# EAGLE design mosfet board_v1 (EAGLE 7.7.0)
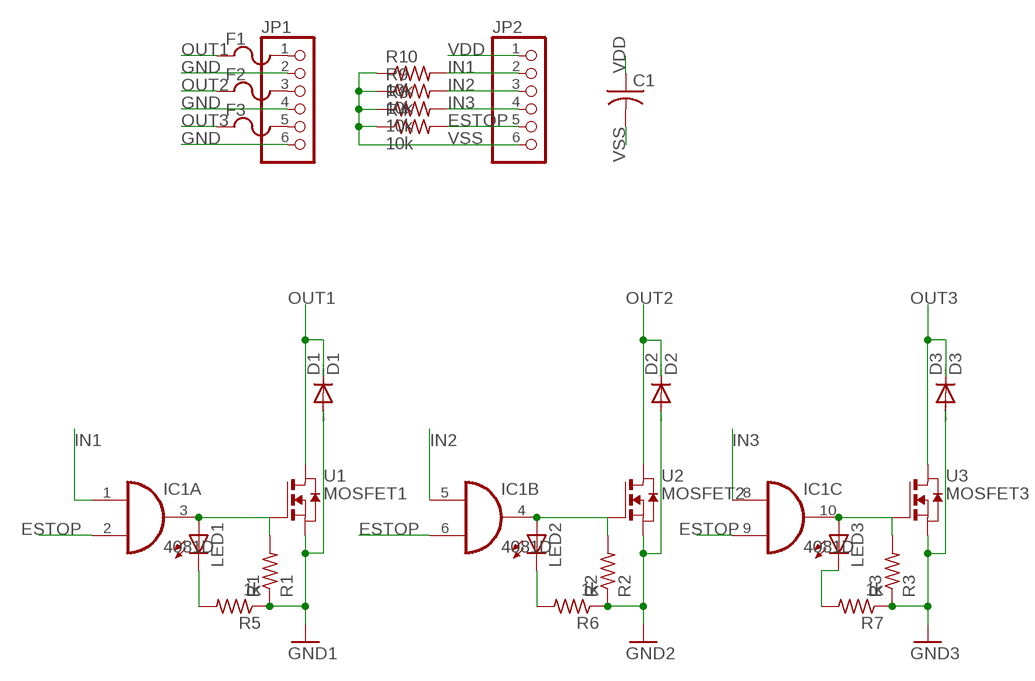
[diagram p0: schematic, sheet 1]

## Parts
C1  C-USC0603  [C0603]
D1  D1  1N4004  [DO41-10]
D2  D2  1N4004  [DO41-10]
D3  D3  1N4004  [DO41-10]
F1  POLYFUSE  [1206]
F2  POLYFUSE  [1206]
F3  POLYFUSE  [1206]
IC1  4081D  [SO14]
JP1  PINHD-1X6  [1X06]
JP2  PINHD-1X6  [1X06]
LED1  LEDCHIPLED_0603  [CHIPLED_0603]
LED2  LEDCHIPLED_0603  [CHIPLED_0603]
LED3  LEDCHIPLED_0603  [CHIPLED_0603]
R1  R1  R-US_R0603  [R0603]
R2  R2  R-US_R0603  [R0603]
R3  R3  R-US_R0603  [R0603]
R4  10k  R-US_R0603  [R0603]
R5  1k  R-US_R0603  [R0603]
R6  1k  R-US_R0603  [R0603]
R7  1k  R-US_R0603  [R0603]
R8  10k  R-US_R0603  [R0603]
R9  10k  R-US_R0603  [R0603]
R10  10k  R-US_R0603  [R0603]
U1  MOSFET1  MOSFET  [MOSFET]
U2  MOSFET2  MOSFET  [MOSFET]
U3  MOSFET3  MOSFET  [MOSFET]

## Nets
ESTOP: IC1.2(A:I1) IC1.6(B:I1) IC1.9(C:I1) JP2.5 R4.2
GND: D1.A D2.A D3.A JP1.2 JP1.4 JP1.6 R1.1 R2.1 R3.1 R5.1 R6.1 R7.1 U1.P$3(S) U2.P$3(S) U3.P$3(S) ; supply symbol labelled GND2, GND1, GND3
IN1: IC1.1(A:I0) JP2.2 R10.2
IN2: IC1.5(B:I0) JP2.3 R9.2
IN3: IC1.8(C:I0) JP2.4 R8.2
N$1: IC1.3(A:O) LED1.A R1.2 U1.P$1(G)
N$4: IC1.4(B:O) LED2.A R2.2 U2.P$1(G)
N$6: IC1.10(C:O) LED3.A R3.2 U3.P$1(G)
N$7: F1.2 JP1.1
N$8: F2.2 JP1.3
N$9: F3.2 JP1.5
N$10: LED1.C R5.2
N$11: LED2.C R6.2
N$12: LED3.C R7.2
OUT1: D1.C F1.1 U1.P$2(D)
OUT2: D2.C F2.1 U2.P$2(D)
OUT3: D3.C F3.1 U3.P$2(D)
VDD: C1.1 JP2.1
VSS: C1.2 JP2.6 R4.1 R8.1 R9.1 R10.1
Unconnected: IC1.11(D:O) IC1.12(D:I0) IC1.13(D:I1)

## Power pins joined to a net without a drawn wire
VDD: IC1.14(P:VDD)
VSS: IC1.7(P:VSS)

## Library data of the parts
C1 = E-P-008-R1.2:C-US: CAPACITOR, American symbol
D1-D3 = diode:1N4004: DIODE general purpose rectifier, 1 A
F1-F3 = polyfuse:POLYFUSE: Resistor Basic schematic elements and footprints for 0603, 1206, and PTH resistors.
IC1 = 40xx:4081: Quad 2-input AND
JP1 JP2 = adafruit:PINHD-1X6: PIN HEADER
LED1-LED3 = adafruit:LED: LED OSRAM: - CHIPLED LG R971, LG N971, LY N971, LG Q971, LY Q971, LO R971, LY R971 LH N974, LH R974 LS Q976, LO Q976, LY Q976 LO Q996 - Hyper CHIPLED LW Q18S LB Q993, LB Q99A, LB R99A - SideLED LS A670, LO A670, LY A670, LG A670, LP A670 LB A673, LV A673, LT A673, LW A673 LH A674 LY A675 LS A676, LA A676, LO A676, LY A676, LW A676 LS A679, LY A679, LG A679 - Hyper Micro SIDELED® LS Y876, LA Y876, LO Y876, LY Y876 LT Y87S - SmartLED LW L88C, LW L88S LB L89C, LB L89S, LG L890 LS L89K, LO L89K, LY L89K LS L896, LA L896, LO L896, LY L896 - TOPLED LS T670, LO T670, LY T670, LG T670, LP T670 LSG T670, LSP T670, LSY T670, LOP T670, LYG T670 LG T671, LOG T671, LSG T671 LB T673, LV T673, LT T673, LW T673 LH T674 LS T676, LA T676, LO T676, LY T676, LB T676, LH T676, LSB T676, LW T676 LB T67C, LV T67C, LT T67C, LS T67K, LO T67K, LY T67K, LW E67C LS E67B, LA E67B, LO E67B, LY E67B, LB E67C, LV E67C, LT E67C LW T67C LS T679, LY T679, LG T679 LS T770, LO T770, LY T770, LG T770, LP T770 LB T773, LV T773, LT T773, LW T773 LH T774 LS E675, LA E675, LY E675, LS T675 LS T776, LA T776, LO T776, LY T776, LB T776 LHGB T686 LT T68C, LB T68C - Hyper Mini TOPLED® LB M676 - Mini TOPLED Santana® LG M470 LS M47K, LO M47K, LY M47K Source: http://www.osram.convergy.de/
R1-R3 R5-R7 = resistor:R-US_: RESISTOR, American symbol
R4 R8-R10 = adafruit:R-US_: RESISTOR, American symbol
U1-U3 = MOSFET:MOSFET

## Board
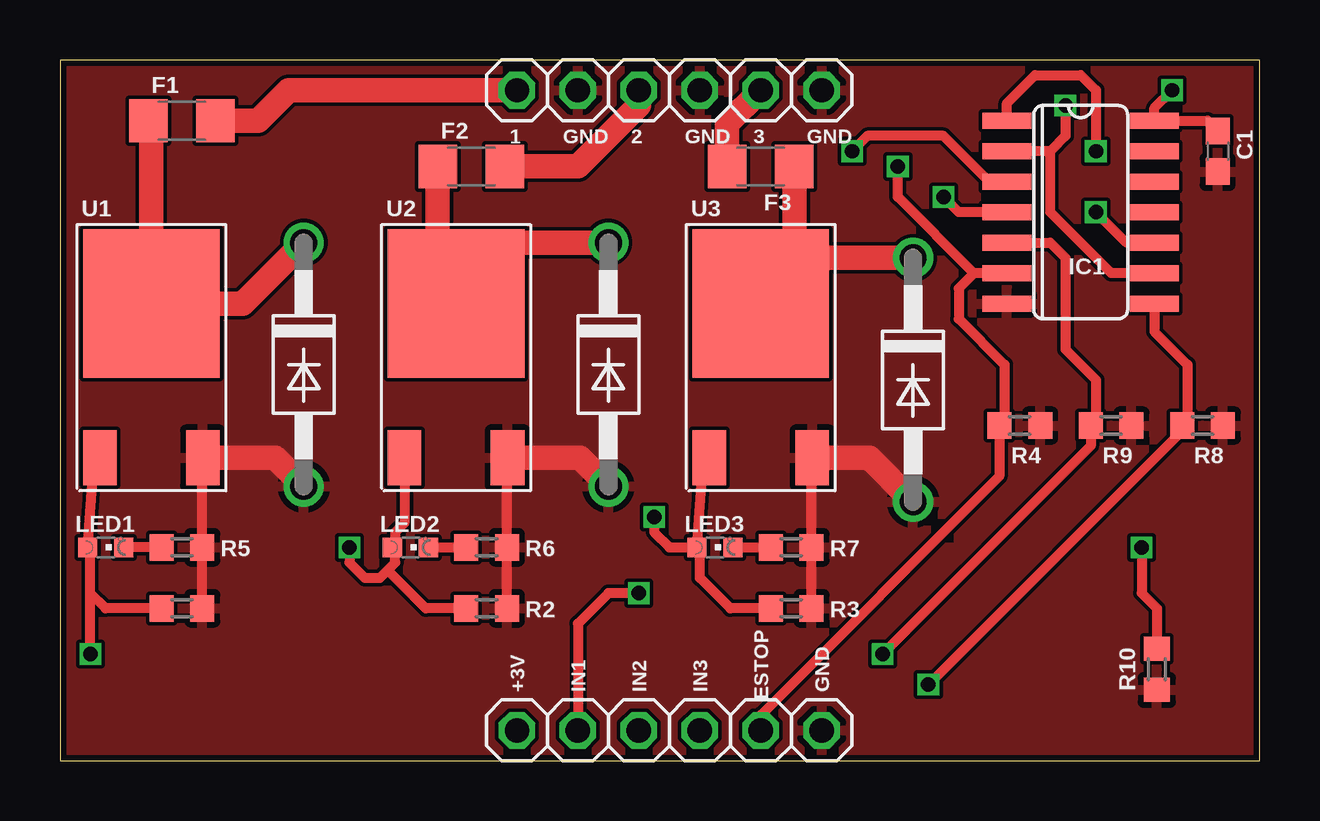
[diagram p1: board, top side]
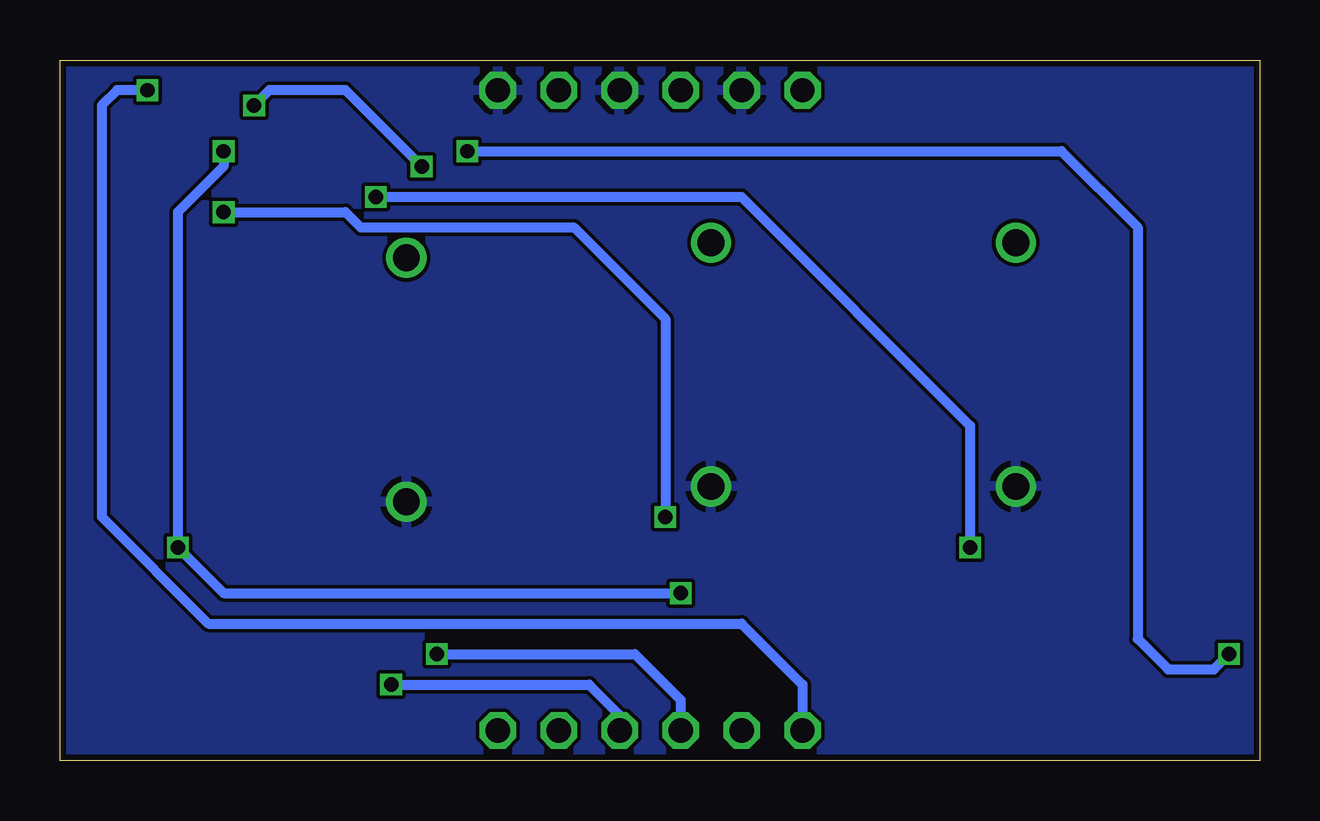
[diagram p2: board, bottom side, seen from below]

Size 50 x 29.2 mm. Coordinates in mm from the lower left corner, seen from the top.
Outline: 0,0 50,0 50,29.2 0,29.2 0,0
Copper layers (1*16): Top 0.035mm / dielectric 1.5mm / Bottom 0.035mm
Design rules "SeeedStudio_2layer_DRU_no_angle_20140221": minimum track width 6mil, minimum drill 12mil, track to track 6mil, track to pad 6mil, pad to pad 6mil, via to via 6mil, smd to smd 0mil, copper to edge 10mil, drill to drill 10mil, minimum pad ring 10mil, minimum via ring 6mil, stop-mask expansion 2mil, vias tented up to drill 100mil, thermal gap 10mil

### Footprints (pad centres in the part's own frame; a part is rotated, then mirrored left to right if it is on the bottom)
C0603 = smd 1.1 x 1: 1 -0.85,0; 2 0.85,0
DO41-10 = drill 1.118: A 5.08,0; C -5.08,0
1206 = smd 1.6 x 1.8: 1 -1.4,0; 2 1.4,0
SO14 = smd 0.66 x 2.032: 1 -3.81,-3.073; 2 -2.54,-3.073; 3 -1.27,-3.073; 4 0,-3.073; 5 1.27,-3.073; 6 2.54,-3.073; 7 3.81,-3.073; 8 3.81,3.073; 9 2.54,3.073; 10 1.27,3.073; 11 0,3.073; 12 -1.27,3.073; 13 -2.54,3.073; 14 -3.81,3.073
1X06 = drill 1.016 octagon: 1 -6.35,0; 2 -3.81,0; 3 -1.27,0; 4 1.27,0; 5 3.81,0; 6 6.35,0
CHIPLED_0603 = smd 0.8 x 0.8: A 0,-0.75; C 0,0.75
R0603 = smd 1 x 1.1: 1 -0.85,0; 2 0.85,0
MOSFET = smd 1.397 x 2.286: P$1 -2.147,-6.43; P$3 2.147,-6.43 | smd 5.69 x 6.18: P$2 0,0

### Placement (x,y rotation side)
C1  48.26,25.4 270 top
D1  10.16,16.51 270 top
D2  22.86,16.51 270 top
D3  35.56,15.88 270 top
F1  5.08,26.67 0 top
F2  17.14,24.77 0 top
F3  29.21,24.77 180 top
IC1  42.55,22.86 270 top
JP1  25.4,27.94 0 top
JP2  25.4,1.27 0 top
LED1  1.91,8.89 270 top
LED2  14.61,8.89 270 top
LED3  27.3,8.89 270 top
R1  5.08,6.35 180 top
R2  17.78,6.35 180 top
R3  30.48,6.35 180 top
R4  40.01,13.97 180 top
R5  5.08,8.89 180 top
R6  17.78,8.89 180 top
R7  30.48,8.89 180 top
R8  47.62,13.97 180 top
R9  43.81,13.97 180 top
R10  45.72,3.81 90 top
U1  3.81,19.05 0 top
U2  16.51,19.05 0 top
U3  29.21,19.05 0 top

### Tracks (layer width: path | path; a pad name or v marks a point on that pad's centre or on a via)
ESTOP  (via drill 0.6)
  Top 0.406: 38.1,20.32 37.47,19.68 37.47,18.41 39.37,16.51 39.37,14.19 R4.2 39.16,11.85 29.21,1.91 JP2.5 | 41.27,25.4 IC1.2 | IC1.6 38.1,20.32 | 38.1,20.32 34.92,23.5 v34.92,24.77 | v41.91,27.3 41.91,26.04 41.27,25.4 | IC1.9 43.81,20.32 41.27,22.86 41.27,25.4
  Bottom 0.406: v34.92,24.77 38.1,27.94 41.27,27.94 v41.91,27.3
GND
  Top 0.406: R3.1 R7.1 31.33,12.59 U3.P$3 | R1.1 R5.1 5.93,12.59 U1.P$3 | R2.1 R6.1 18.63,12.59 U2.P$3
  Top 1.016: U1.P$3 8.97,12.62 D1.A | U2.P$3 21.67,12.62 D2.A | U3.P$3 33.73,12.62 D3.A
  pour Bottom: -2.54,33.02 52.07,33.02 52.07,-3.81 -2.54,-3.81
  pour Top (rank 6): -1.91,32.38 40.64,32.38 40.64,-3.81 -1.91,-3.81
IN1  (via drill 0.6)
  Top 0.406: IC1.1 39.47,27.41 40.64,28.57 42.55,28.57 43.18,27.94 v43.18,25.4 | v24.13,6.99 22.86,6.99 21.59,5.71 JP2.2 | v45.09,8.89 45.09,6.99 45.72,6.35 R10.2
  Bottom 0.406: v43.18,25.4 43.18,24.77 45.09,22.86 v45.09,8.89 43.18,6.99 v24.13,6.99
IN2  (via drill 0.6)
  Top 0.406: IC1.5 41.27,21.59 41.91,20.95 41.91,17.14 43.18,15.88 43.18,14.19 R9.2 42.97,13.12 v34.29,4.45
  Bottom 0.406: v34.29,4.45 26.04,4.45 24.13,2.54 JP2.3
IN3  (via drill 0.6)
  Top 0.406: IC1.8 45.62,17.88 46.99,16.51 46.99,14.19 R8.2 46.77,13.76 v36.2,3.17
  Bottom 0.406: v36.2,3.17 27.94,3.17 26.67,1.91 JP2.4
N$1  (via drill 0.6)
  Top 0.406: v33.02,25.4 33.66,26.04 36.83,26.04 38.73,24.13 IC1.3 | v1.27,4.45 1.27,6.99 | 1.27,6.99 1.27,8.76 LED1.A 1.41,12.36 U1.P$1 | R1.2 1.91,6.35 1.27,6.99
  Bottom 0.406: v33.02,25.4 8.26,25.4 5.08,22.23 5.08,5.08 3.81,3.81 1.91,3.81 v1.27,4.45
N$4  (via drill 0.6)
  Top 0.406: IC1.4 37.47,22.86 v36.83,23.5 | v12.06,8.89 12.06,8.26 12.7,7.62 13.34,7.62 13.65,7.94 | 13.65,7.94 13.97,8.26 13.97,8.76 LED2.A 13.97,9.03 13.97,9.53 14.36,9.92 U2.P$1 | R2.2 15.24,6.35 13.65,7.94
  Bottom 0.406: v36.83,23.5 21.59,23.5 12.06,13.97 v12.06,8.89
N$6  (via drill 0.6)
  Top 0.406: R3.2 27.94,6.35 26.67,7.62 26.67,8.76 LED3.A | LED3.A 26.8,12.36 U3.P$1 | IC1.10 44.45,21.59 v43.18,22.86 | v24.77,10.16 24.77,9.53 25.4,8.89 LED3.A
  Bottom 0.406: v43.18,22.86 38.1,22.86 37.47,22.23 28.57,22.23 24.77,18.41 v24.77,10.16
N$7
  Top 1.016: F1.2 8.26,26.67 9.53,27.94 JP1.1
N$8
  Top 1.016: F2.2 21.59,24.77 24.13,27.3 JP1.3
N$9
  Top 1.016: F3.2 27.81,26.54 JP1.5
N$10
  Top 0.406: R5.2 LED1.C
N$11
  Top 0.406: LED2.C R6.2
N$12
  Top 0.406: LED3.C R7.2
OUT1
  Top 1.016: F1.1 3.81,26.54 U1.P$2 7.62,19.05 D1.C
OUT2
  Top 1.016: F2.1 15.74,19.82 U2.P$2 19.05,21.59 D2.C
OUT3
  Top 1.016: F3.1 30.61,20.45 U3.P$2 28.57,19.68 29.84,20.95 D3.C
VDD  (via drill 0.6)
  Top 0.406: C1.1 47.84,26.67 IC1.14 45.62,27.2 v46.35,27.94
  Bottom 0.406: v46.35,27.94 47.62,27.94 48.26,27.3 48.26,10.16 43.81,5.71 21.59,5.71 19.05,3.17 JP2.1
VSS
  pour Top: 37.47,-3.81 37.47,33.02 52.07,33.02 52.07,-3.81
  pour Top: 11.43,8.89 52.07,8.89 52.07,-3.81 11.43,-3.81

### Text on the board
tPlace: 1 | GND | 2 | GND | 3 | GND | +3V | IN1 | IN2 | IN3 | ESTOP | GND